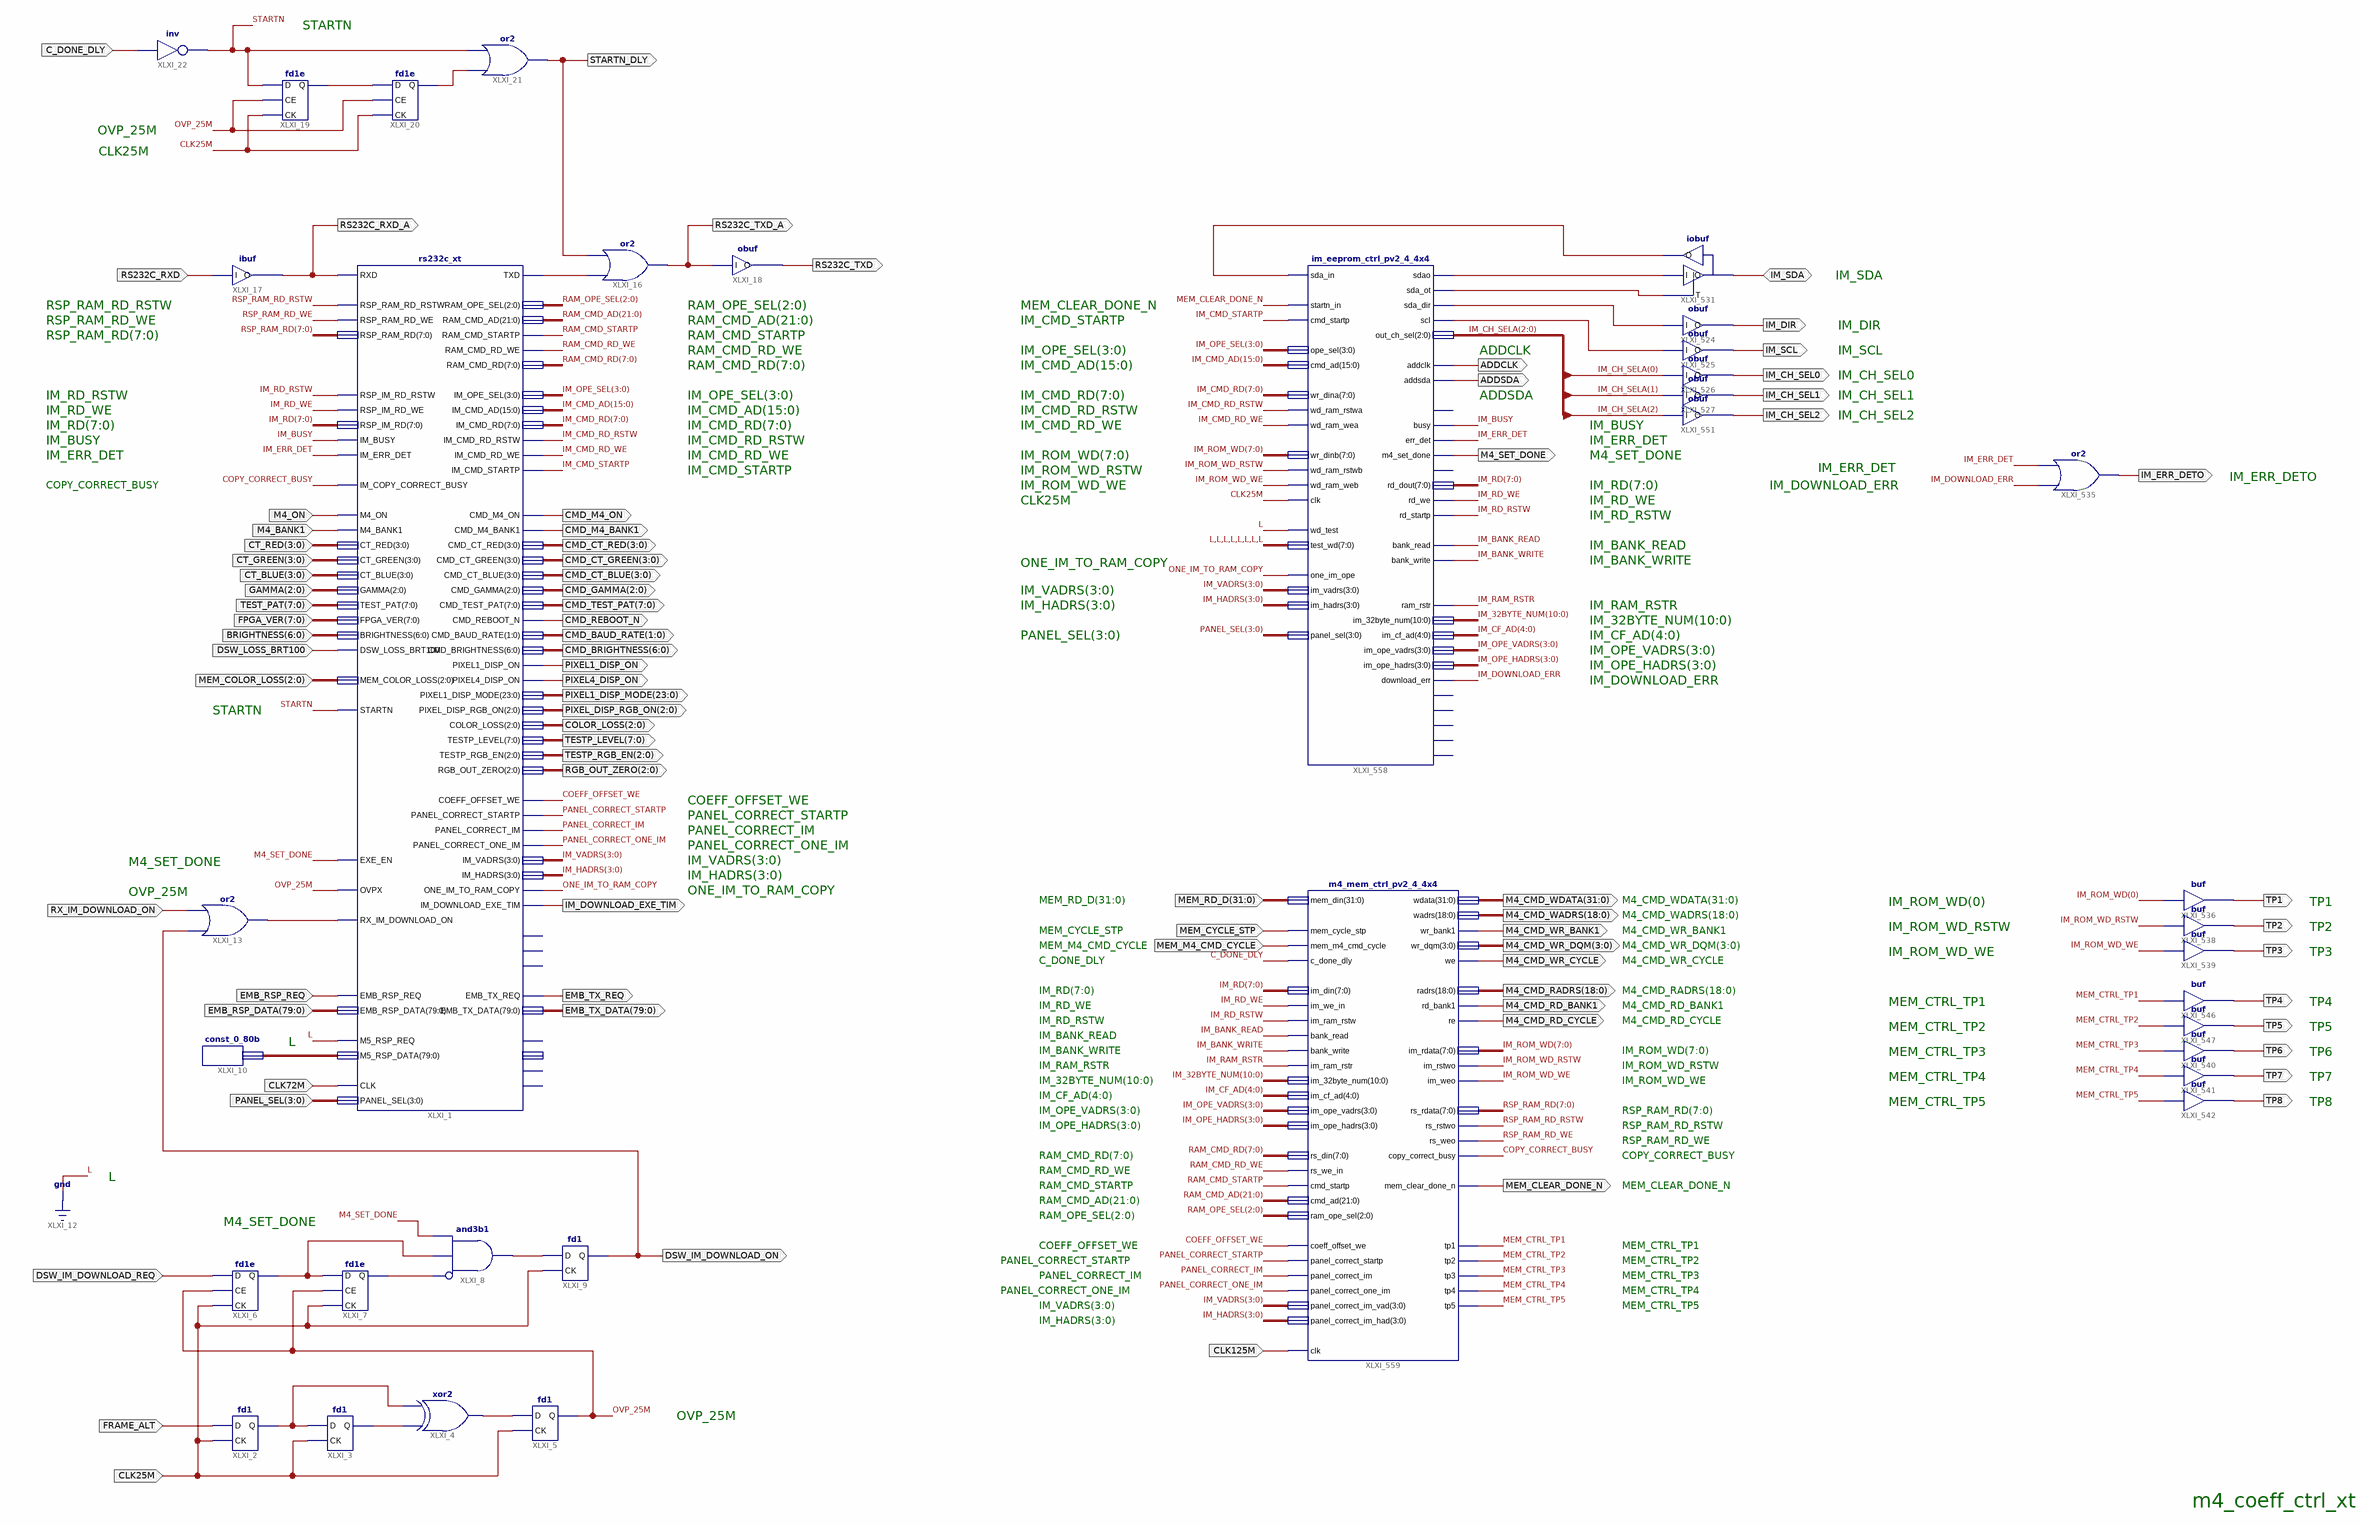
[diagram p0: schematic sheet 1]
// Xilinx ISE schematic m4_coeff_ctrl_xt.sch (spartan6) as structural Verilog: 35 symbols, 78 ports
module m4_coeff_ctrl_xt (
  input  FRAME_ALT,
  input  CLK25M,
  input  DSW_IM_DOWNLOAD_REQ,
  input  EMB_RSP_REQ,
  input  [79:0] EMB_RSP_DATA,
  input  CLK72M,
  input  RX_IM_DOWNLOAD_ON,
  input  M4_ON,
  input  M4_BANK1,
  input  [3:0] CT_RED,
  input  [3:0] CT_GREEN,
  input  [3:0] CT_BLUE,
  input  [2:0] GAMMA,
  input  [7:0] TEST_PAT,
  input  [7:0] FPGA_VER,
  input  [6:0] BRIGHTNESS,
  input  DSW_LOSS_BRT100,
  input  [2:0] MEM_COLOR_LOSS,
  input  RS232C_RXD,
  input  C_DONE_DLY,
  input  [3:0] PANEL_SEL,
  input  MEM_M4_CMD_CYCLE,
  input  MEM_CYCLE_STP,
  input  [31:0] MEM_RD_D,
  input  CLK125M,
  inout  IM_SDA,
  output M4_SET_DONE,
  output DSW_IM_DOWNLOAD_ON,
  output RS232C_RXD_A,
  output STARTN_DLY,
  output RS232C_TXD_A,
  output RS232C_TXD,
  output CMD_M4_ON,
  output CMD_M4_BANK1,
  output [3:0] CMD_CT_RED,
  output [3:0] CMD_CT_GREEN,
  output [3:0] CMD_CT_BLUE,
  output [2:0] CMD_GAMMA,
  output [7:0] CMD_TEST_PAT,
  output CMD_REBOOT_N,
  output [1:0] CMD_BAUD_RATE,
  output [6:0] CMD_BRIGHTNESS,
  output PIXEL1_DISP_ON,
  output PIXEL4_DISP_ON,
  output [23:0] PIXEL1_DISP_MODE,
  output [2:0] PIXEL_DISP_RGB_ON,
  output [2:0] COLOR_LOSS,
  output [7:0] TESTP_LEVEL,
  output [2:0] TESTP_RGB_EN,
  output [2:0] RGB_OUT_ZERO,
  output IM_DOWNLOAD_EXE_TIM,
  output EMB_TX_REQ,
  output [79:0] EMB_TX_DATA,
  output IM_DIR,
  output IM_SCL,
  output IM_CH_SEL0,
  output IM_CH_SEL1,
  output ADDCLK,
  output ADDSDA,
  output M4_CMD_WR_CYCLE,
  output [31:0] M4_CMD_WDATA,
  output [18:0] M4_CMD_WADRS,
  output M4_CMD_WR_BANK1,
  output [3:0] M4_CMD_WR_DQM,
  output [18:0] M4_CMD_RADRS,
  output M4_CMD_RD_BANK1,
  output M4_CMD_RD_CYCLE,
  output MEM_CLEAR_DONE_N,
  output IM_ERR_DETO,
  output TP1,
  output TP2,
  output TP3,
  output TP6,
  output TP7,
  output TP8,
  output TP4,
  output TP5,
  output IM_CH_SEL2
);

  wire COEFF_OFFSET_WE, COPY_CORRECT_BUSY, IM_BANK_READ, IM_BANK_WRITE, IM_BUSY, IM_CMD_RD_RSTW,
       IM_CMD_RD_WE, IM_CMD_STARTP, IM_DOWNLOAD_ERR, IM_ERR_DET, IM_RAM_RSTR, IM_RD_RSTW, IM_RD_WE,
       IM_ROM_WD_RSTW, IM_ROM_WD_WE, MEM_CTRL_TP1, MEM_CTRL_TP2, MEM_CTRL_TP3, MEM_CTRL_TP4, MEM_CTRL_TP5,
       ONE_IM_TO_RAM_COPY, OVP_25M, PANEL_CORRECT_IM, PANEL_CORRECT_ONE_IM, PANEL_CORRECT_STARTP,
       RAM_CMD_RD_WE, RAM_CMD_STARTP, RSP_RAM_RD_RSTW, RSP_RAM_RD_WE, STARTN, XLXN_3, XLXN_4, XLXN_6,
       XLXN_29, XLXN_30, XLXN_32, XLXN_45, XLXN_63, XLXN_64, XLXN_84, XLXN_111, XLXN_113, XLXN_115, XLXN_116,
       XLXN_118;
  wire [2:0] IM_CH_SELA, RAM_OPE_SEL;
  wire [3:0] IM_HADRS, IM_OPE_HADRS, IM_OPE_SEL, IM_OPE_VADRS, IM_VADRS;
  wire [4:0] IM_CF_AD;
  wire [7:0] IM_CMD_RD, IM_RD, IM_ROM_WD, RAM_CMD_RD, RSP_RAM_RD;
  wire [10:0] IM_32BYTE_NUM;
  wire [15:0] IM_CMD_AD;
  wire [21:0] RAM_CMD_AD;
  wire [79:0] XLXN_39;

  rs232c_xt XLXI_1 (
    .RXD(RS232C_RXD_A), .CLK(CLK72M), .RSP_RAM_RD_RSTW(RSP_RAM_RD_RSTW), .RSP_RAM_RD_WE(RSP_RAM_RD_WE),
    .RSP_RAM_RD(RSP_RAM_RD), .RSP_IM_RD_RSTW(IM_RD_RSTW), .RSP_IM_RD_WE(IM_RD_WE), .RSP_IM_RD(IM_RD),
    .IM_BUSY(IM_BUSY), .IM_ERR_DET(IM_ERR_DET), .M4_ON(M4_ON), .M4_BANK1(M4_BANK1), .CT_RED(CT_RED),
    .CT_GREEN(CT_GREEN), .CT_BLUE(CT_BLUE), .GAMMA(GAMMA), .TEST_PAT(TEST_PAT), .FPGA_VER(FPGA_VER),
    .BRIGHTNESS(BRIGHTNESS), .DSW_LOSS_BRT100(DSW_LOSS_BRT100), .MEM_COLOR_LOSS(MEM_COLOR_LOSS),
    .STARTN(STARTN), .IM_COPY_CORRECT_BUSY(COPY_CORRECT_BUSY), .RX_IM_DOWNLOAD_ON(XLXN_45),
    .EMB_RSP_REQ(EMB_RSP_REQ), .EMB_RSP_DATA(EMB_RSP_DATA), .M5_RSP_REQ(1'b0), .M5_RSP_DATA(XLXN_39),
    .EXE_EN(M4_SET_DONE), .OVPX(OVP_25M), .CMD_BAUD_RATE(CMD_BAUD_RATE), .RAM_OPE_SEL(RAM_OPE_SEL),
    .RAM_CMD_AD(RAM_CMD_AD), .RAM_CMD_STARTP(RAM_CMD_STARTP), .RAM_CMD_RD_WE(RAM_CMD_RD_WE),
    .RAM_CMD_RD(RAM_CMD_RD), .IM_OPE_SEL(IM_OPE_SEL), .IM_CMD_AD(IM_CMD_AD), .IM_CMD_RD(IM_CMD_RD),
    .IM_CMD_RD_RSTW(IM_CMD_RD_RSTW), .IM_CMD_RD_WE(IM_CMD_RD_WE), .IM_CMD_STARTP(IM_CMD_STARTP),
    .CMD_M4_ON(CMD_M4_ON), .CMD_M4_BANK1(CMD_M4_BANK1), .CMD_CT_RED(CMD_CT_RED), .CMD_CT_GREEN(CMD_CT_GREEN),
    .CMD_CT_BLUE(CMD_CT_BLUE), .CMD_GAMMA(CMD_GAMMA), .CMD_TEST_PAT(CMD_TEST_PAT),
    .CMD_REBOOT_N(CMD_REBOOT_N), .CMD_BRIGHTNESS(CMD_BRIGHTNESS), .PIXEL1_DISP_ON(PIXEL1_DISP_ON),
    .PIXEL4_DISP_ON(PIXEL4_DISP_ON), .PIXEL1_DISP_MODE(PIXEL1_DISP_MODE),
    .PIXEL_DISP_RGB_ON(PIXEL_DISP_RGB_ON), .COLOR_LOSS(COLOR_LOSS), .TESTP_LEVEL(TESTP_LEVEL),
    .TESTP_RGB_EN(TESTP_RGB_EN), .RGB_OUT_ZERO(RGB_OUT_ZERO), .COEFF_OFFSET_WE(COEFF_OFFSET_WE),
    .PANEL_CORRECT_STARTP(PANEL_CORRECT_STARTP), .PANEL_CORRECT_IM(PANEL_CORRECT_IM),
    .ONE_IM_TO_RAM_COPY(ONE_IM_TO_RAM_COPY), .IM_DOWNLOAD_EXE_TIM(IM_DOWNLOAD_EXE_TIM),
    .EMB_TX_DATA(EMB_TX_DATA), .EMB_TX_REQ(EMB_TX_REQ), .TXD(XLXN_84),
    .PANEL_CORRECT_ONE_IM(PANEL_CORRECT_ONE_IM), .IM_VADRS(IM_VADRS), .IM_HADRS(IM_HADRS),
    .PANEL_SEL(PANEL_SEL));  // open: TX_DONE, TP1, TP2, TP3, M5_TX_REQ, M5_TX_DATA, M5_RSP_RAM_RE
  fd1 XLXI_2 (.D(FRAME_ALT), .CK(CLK25M), .Q(XLXN_3));
  fd1 XLXI_3 (.D(XLXN_3), .CK(CLK25M), .Q(XLXN_4));
  xor XLXI_4 (XLXN_6, XLXN_4, XLXN_3);
  fd1 XLXI_5 (.D(XLXN_6), .CK(CLK25M), .Q(OVP_25M));
  fd1e XLXI_6 (.CE(OVP_25M), .CK(CLK25M), .D(DSW_IM_DOWNLOAD_REQ), .Q(XLXN_29));
  fd1e XLXI_7 (.CE(OVP_25M), .CK(CLK25M), .D(XLXN_29), .Q(XLXN_30));
  const_0_80b XLXI_10 (.dout(XLXN_39));
  or XLXI_13 (XLXN_45, DSW_IM_DOWNLOAD_ON, RX_IM_DOWNLOAD_ON);
  or XLXI_16 (RS232C_TXD_A, XLXN_84, STARTN_DLY);
  ibuf XLXI_17 (.I(RS232C_RXD), .O(RS232C_RXD_A));
  obuf XLXI_18 (.I(RS232C_TXD_A), .O(RS232C_TXD));
  fd1e XLXI_19 (.CE(OVP_25M), .CK(CLK25M), .D(STARTN), .Q(XLXN_63));
  fd1e XLXI_20 (.CE(OVP_25M), .CK(CLK25M), .D(XLXN_63), .Q(XLXN_64));
  or XLXI_21 (STARTN_DLY, XLXN_64, STARTN);
  not XLXI_22 (STARTN, C_DONE_DLY);
  fd1 XLXI_9 (.D(XLXN_32), .CK(CLK25M), .Q(DSW_IM_DOWNLOAD_ON));
  and XLXI_8 (XLXN_32, ~XLXN_30, XLXN_29, M4_SET_DONE);  // and3b1
  iobuf XLXI_531 (.I(XLXN_116), .IO(IM_SDA), .O(XLXN_118), .T(XLXN_115));
  obuf XLXI_524 (.I(XLXN_113), .O(IM_DIR));
  obuf XLXI_525 (.I(XLXN_111), .O(IM_SCL));
  obuf XLXI_526 (.I(IM_CH_SELA[0]), .O(IM_CH_SEL0));
  obuf XLXI_527 (.I(IM_CH_SELA[1]), .O(IM_CH_SEL1));
  or XLXI_535 (IM_ERR_DETO, IM_DOWNLOAD_ERR, IM_ERR_DET);
  buf XLXI_536 (TP1, IM_ROM_WD[0]);
  buf XLXI_538 (TP2, IM_ROM_WD_RSTW);
  buf XLXI_539 (TP3, IM_ROM_WD_WE);
  buf XLXI_540 (TP6, MEM_CTRL_TP3);
  buf XLXI_541 (TP7, MEM_CTRL_TP4);
  buf XLXI_542 (TP8, MEM_CTRL_TP5);
  buf XLXI_546 (TP4, MEM_CTRL_TP1);
  buf XLXI_547 (TP5, MEM_CTRL_TP2);
  obuf XLXI_551 (.I(IM_CH_SELA[2]), .O(IM_CH_SEL2));
  im_eeprom_ctrl_pv2_4_4x4 XLXI_558 (
    .startn_in(MEM_CLEAR_DONE_N), .cmd_startp(IM_CMD_STARTP), .clk(CLK25M), .one_im_ope(ONE_IM_TO_RAM_COPY),
    .sda_in(XLXN_118), .wd_ram_rstwa(IM_CMD_RD_RSTW), .wd_ram_rstwb(IM_ROM_WD_RSTW),
    .wd_ram_wea(IM_CMD_RD_WE), .wd_ram_web(IM_ROM_WD_WE), .wd_test(1'b0), .panel_sel(PANEL_SEL),
    .ope_sel(IM_OPE_SEL), .im_hadrs(IM_HADRS), .im_vadrs(IM_VADRS), .wr_dina(IM_CMD_RD), .wr_dinb(IM_ROM_WD),
    .test_wd({8{1'b0}}), .cmd_ad(IM_CMD_AD), .addclk(ADDCLK), .addsda(ADDSDA), .busy(IM_BUSY),
    .err_det(IM_ERR_DET), .m4_set_done(M4_SET_DONE), .bank_read(IM_BANK_READ), .bank_write(IM_BANK_WRITE),
    .ram_rstr(IM_RAM_RSTR), .scl(XLXN_111), .sda_ot(XLXN_115), .sda_dir(XLXN_113), .sdao(XLXN_116),
    .rd_we(IM_RD_WE), .rd_startp(IM_RD_RSTW), .download_err(IM_DOWNLOAD_ERR), .im_32byte_num(IM_32BYTE_NUM),
    .im_cf_ad(IM_CF_AD), .im_ope_hadrs(IM_OPE_HADRS), .im_ope_vadrs(IM_OPE_VADRS), .out_ch_sel(IM_CH_SELA),
    .rd_dout(IM_RD));  // open: cnt_rst, m4_set_err, tp1, tp2, tp3, tp4, tp5
  m4_mem_ctrl_pv2_4_4x4 XLXI_559 (
    .c_done_dly(C_DONE_DLY), .mem_cycle_stp(MEM_CYCLE_STP), .mem_m4_cmd_cycle(MEM_M4_CMD_CYCLE),
    .bank_read(IM_BANK_READ), .bank_write(IM_BANK_WRITE), .panel_correct_im(PANEL_CORRECT_IM),
    .panel_correct_one_im(PANEL_CORRECT_ONE_IM), .panel_correct_startp(PANEL_CORRECT_STARTP),
    .coeff_offset_we(COEFF_OFFSET_WE), .im_we_in(IM_RD_WE), .im_ram_rstw(IM_RD_RSTW),
    .cmd_startp(RAM_CMD_STARTP), .rs_we_in(RAM_CMD_RD_WE), .im_ram_rstr(IM_RAM_RSTR), .clk(CLK125M),
    .ram_ope_sel(RAM_OPE_SEL), .panel_correct_im_vad(IM_VADRS), .panel_correct_im_had(IM_HADRS),
    .rs_din(RAM_CMD_RD), .im_cf_ad(IM_CF_AD), .im_ope_vadrs(IM_OPE_VADRS), .im_ope_hadrs(IM_OPE_HADRS),
    .im_din(IM_RD), .mem_din(MEM_RD_D), .cmd_ad(RAM_CMD_AD), .im_32byte_num(IM_32BYTE_NUM),
    .copy_correct_busy(COPY_CORRECT_BUSY), .mem_clear_done_n(MEM_CLEAR_DONE_N), .we(M4_CMD_WR_CYCLE),
    .wr_bank1(M4_CMD_WR_BANK1), .im_rstwo(IM_ROM_WD_RSTW), .im_weo(IM_ROM_WD_WE), .rs_rstwo(RSP_RAM_RD_RSTW),
    .rs_weo(RSP_RAM_RD_WE), .re(M4_CMD_RD_CYCLE), .rd_bank1(M4_CMD_RD_BANK1), .tp1(MEM_CTRL_TP1),
    .tp2(MEM_CTRL_TP2), .tp3(MEM_CTRL_TP3), .tp4(MEM_CTRL_TP4), .tp5(MEM_CTRL_TP5), .wadrs(M4_CMD_WADRS),
    .wdata(M4_CMD_WDATA), .wr_dqm(M4_CMD_WR_DQM), .im_rdata(IM_ROM_WD), .rs_rdata(RSP_RAM_RD),
    .radrs(M4_CMD_RADRS));

  // Notes on the sheet:
  //   STARTN
  //   OVP_25M
  //   CLK25M
  //   IM_SDA
  //   RSP_RAM_RD_RSTW
  //   RAM_OPE_SEL(2:0)
  //   MEM_CLEAR_DONE_N
  //   RSP_RAM_RD_WE
  //   RAM_CMD_AD(21:0)
  //   IM_CMD_STARTP
  //   IM_DIR
  //   RSP_RAM_RD(7:0)
  //   RAM_CMD_STARTP
  //   RAM_CMD_RD_WE
  //   IM_OPE_SEL(3:0)
  //   ADDCLK
  //   IM_SCL
  //   RAM_CMD_RD(7:0)
  //   IM_CMD_AD(15:0)
  //   IM_CH_SEL0
  //   IM_RD_RSTW
  //   IM_OPE_SEL(3:0)
  //   IM_CMD_RD(7:0)
  //   ADDSDA
  //   IM_CH_SEL1
  //   IM_RD_WE
  //   IM_CMD_AD(15:0)
  //   IM_CMD_RD_RSTW
  //   IM_CH_SEL2
  //   IM_RD(7:0)
  //   IM_CMD_RD(7:0)
  //   IM_CMD_RD_WE
  //   IM_BUSY
  //   IM_BUSY
  //   IM_CMD_RD_RSTW
  //   IM_ERR_DET
  //   IM_ERR_DET
  //   IM_CMD_RD_WE
  //   IM_ROM_WD(7:0)
  //   M4_SET_DONE
  //   IM_ERR_DET
  //   IM_CMD_STARTP
  //   IM_ROM_WD_RSTW
  //   IM_ERR_DETO
  //   COPY_CORRECT_BUSY
  //   IM_ROM_WD_WE
  //   IM_RD(7:0)
  //   IM_DOWNLOAD_ERR
  //   CLK25M
  //   IM_RD_WE
  //   IM_RD_RSTW
  //   IM_BANK_READ
  //   IM_BANK_WRITE
  //   ONE_IM_TO_RAM_COPY
  //   IM_VADRS(3:0)
  //   IM_HADRS(3:0)
  //   IM_RAM_RSTR
  //   IM_32BYTE_NUM(10:0)
  //   PANEL_SEL(3:0)
  //   IM_CF_AD(4:0)
  //   IM_OPE_VADRS(3:0)
  //   IM_OPE_HADRS(3:0)
  //   IM_DOWNLOAD_ERR
  //   STARTN
  //   COEFF_OFFSET_WE
  //   PANEL_CORRECT_STARTP
  //   PANEL_CORRECT_IM
  //   PANEL_CORRECT_ONE_IM
  //   IM_VADRS(3:0)
  //   M4_SET_DONE
  //   IM_HADRS(3:0)
  //   ONE_IM_TO_RAM_COPY
  //   OVP_25M
  //   MEM_RD_D(31:0)
  //   M4_CMD_WDATA(31:0)
  //   IM_ROM_WD(0)
  //   TP1
  //   M4_CMD_WADRS(18:0)
  //   IM_ROM_WD_RSTW
  //   TP2
  //   MEM_CYCLE_STP
  //   M4_CMD_WR_BANK1
  //   MEM_M4_CMD_CYCLE
  //   M4_CMD_WR_DQM(3:0)
  //   IM_ROM_WD_WE
  //   TP3
  //   C_DONE_DLY
  //   M4_CMD_WR_CYCLE
  //   IM_RD(7:0)
  //   M4_CMD_RADRS(18:0)
  //   MEM_CTRL_TP1
  //   TP4
  //   IM_RD_WE
  //   M4_CMD_RD_BANK1
  //   IM_RD_RSTW
  //   M4_CMD_RD_CYCLE
  //   MEM_CTRL_TP2
  //   TP5
  //   IM_BANK_READ
  //   L
  //   IM_BANK_WRITE
  //   IM_ROM_WD(7:0)
  //   MEM_CTRL_TP3
  //   TP6
  //   IM_RAM_RSTR
  //   IM_ROM_WD_RSTW
  //   MEM_CTRL_TP4
  //   TP7
  //   IM_32BYTE_NUM(10:0)
  //   IM_ROM_WD_WE
  //   IM_CF_AD(4:0)
  //   MEM_CTRL_TP5
  //   TP8
  //   IM_OPE_VADRS(3:0)
  //   RSP_RAM_RD(7:0)
  //   IM_OPE_HADRS(3:0)
  //   RSP_RAM_RD_RSTW
  //   RSP_RAM_RD_WE
  //   RAM_CMD_RD(7:0)
  //   COPY_CORRECT_BUSY
  //   RAM_CMD_RD_WE
  //   L
  //   RAM_CMD_STARTP
  //   MEM_CLEAR_DONE_N
  //   RAM_CMD_AD(21:0)
  //   RAM_OPE_SEL(2:0)
  //   M4_SET_DONE
  //   COEFF_OFFSET_WE
  //   MEM_CTRL_TP1
  //   PANEL_CORRECT_STARTP
  //   MEM_CTRL_TP2
  //   PANEL_CORRECT_IM
  //   MEM_CTRL_TP3
  //   PANEL_CORRECT_ONE_IM
  //   MEM_CTRL_TP4
  //   IM_VADRS(3:0)
  //   MEM_CTRL_TP5
  //   IM_HADRS(3:0)
  //   OVP_25M
  //   m4_coeff_ctrl_xt
endmodule
